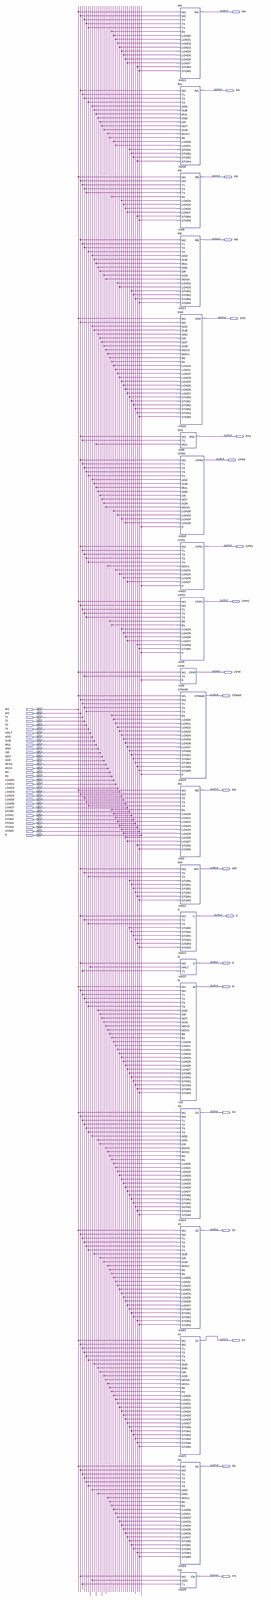
[diagram p0: schematic sheet, whole]
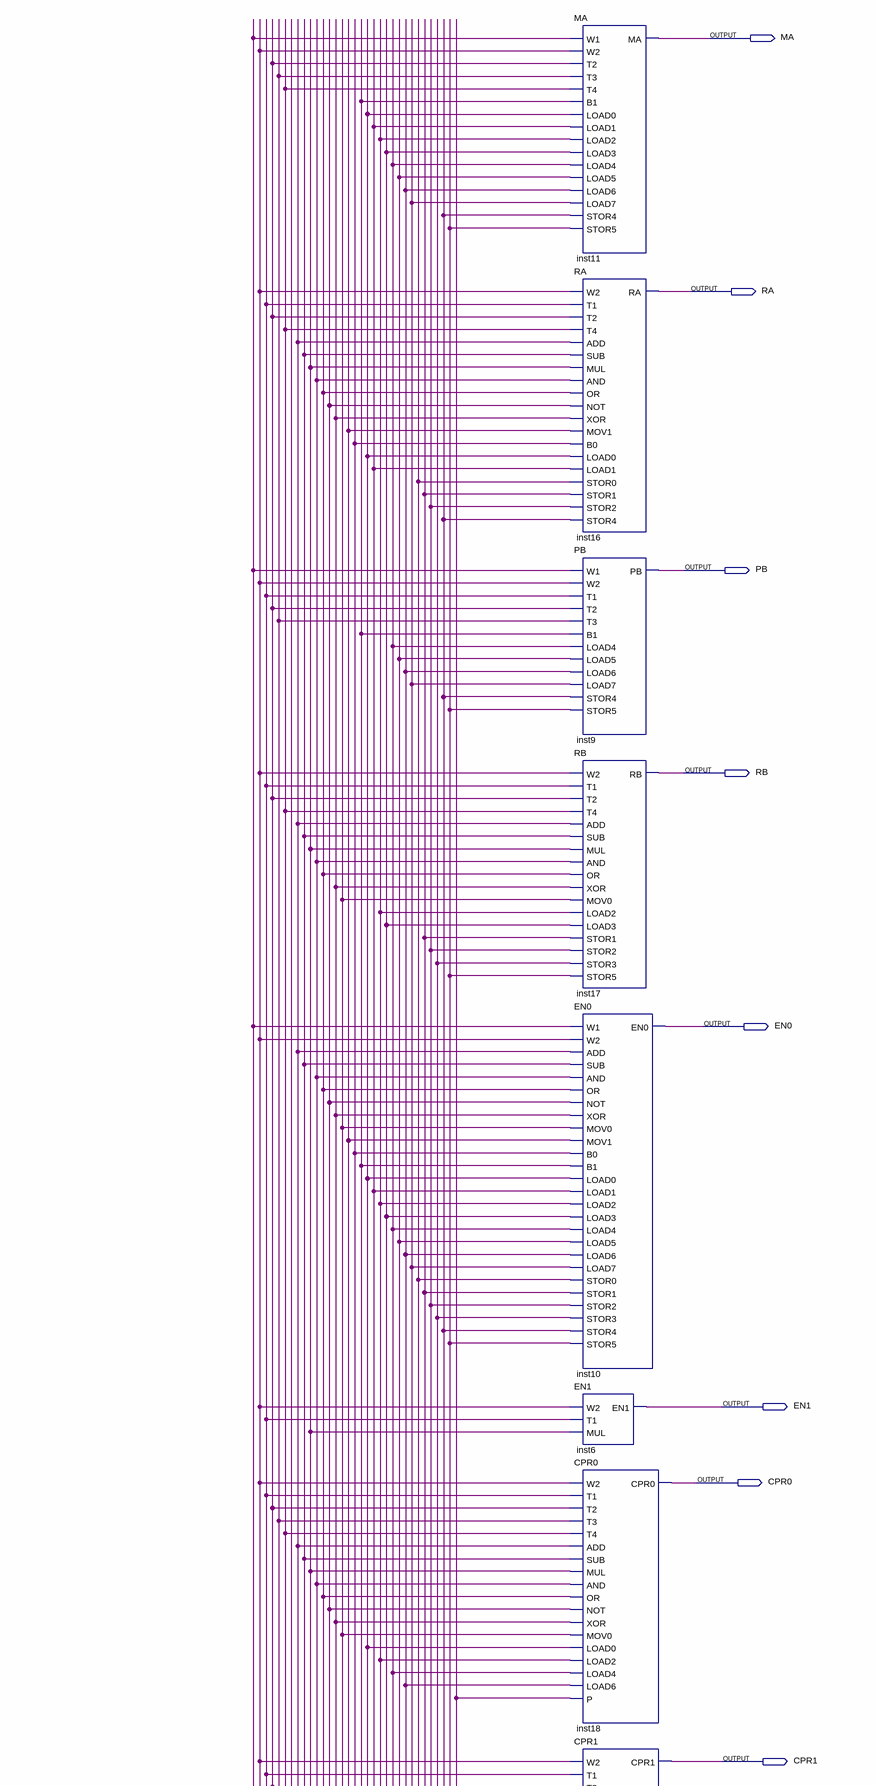
[diagram p1: schematic sheet, upper part]
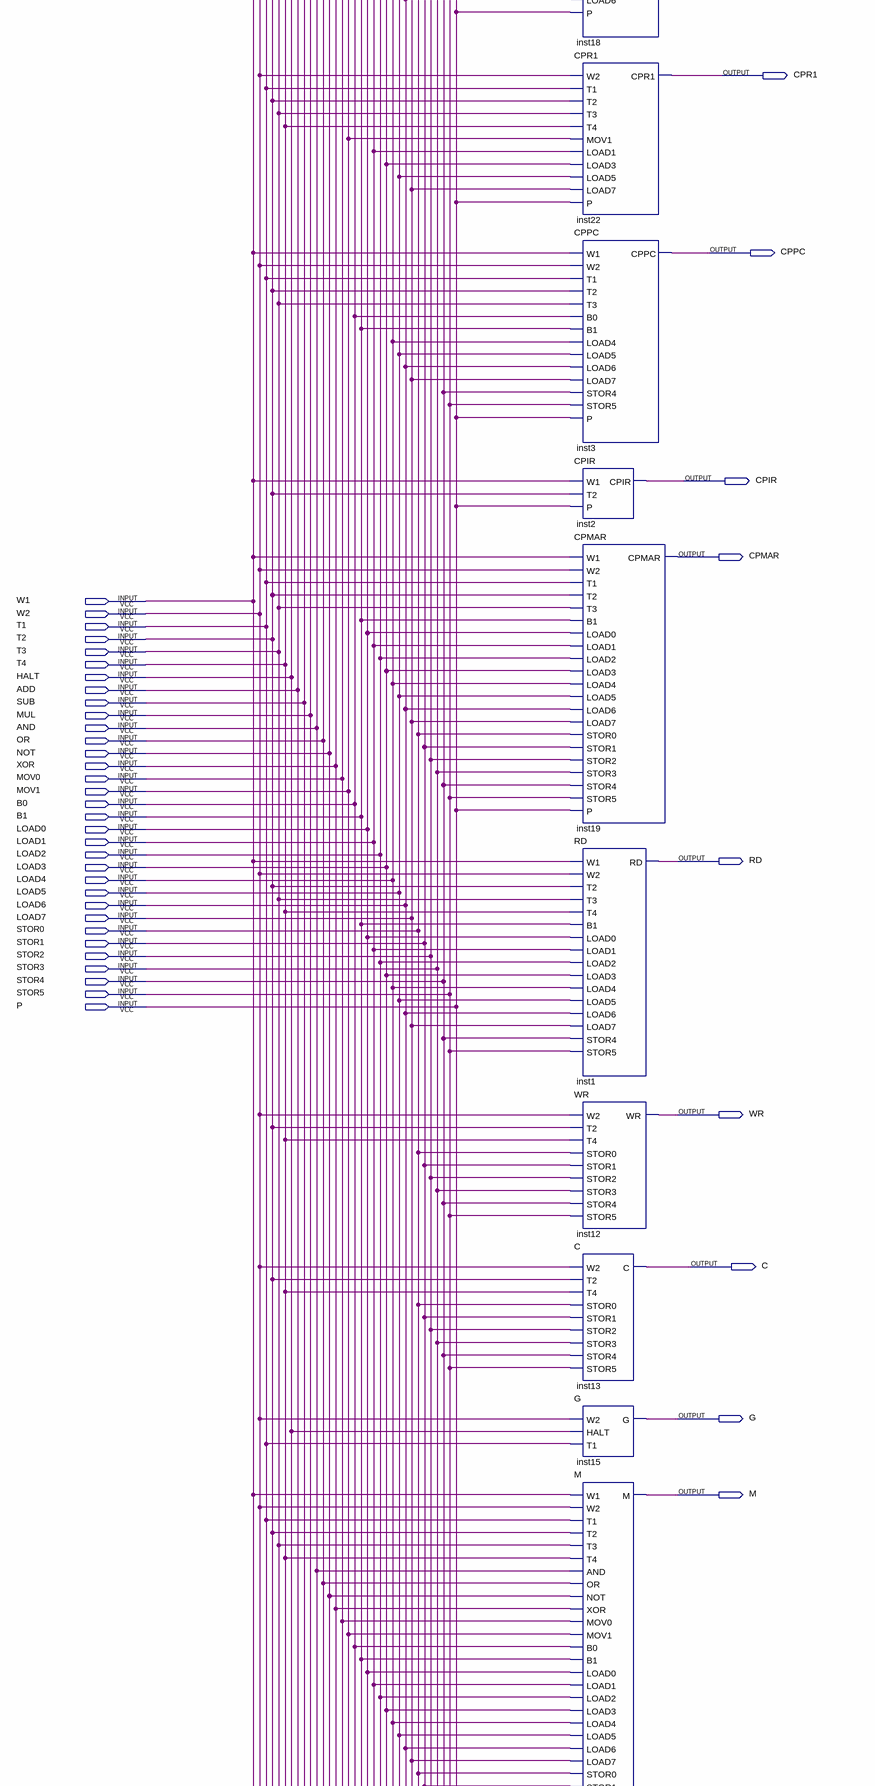
[diagram p2: schematic sheet, middle part]
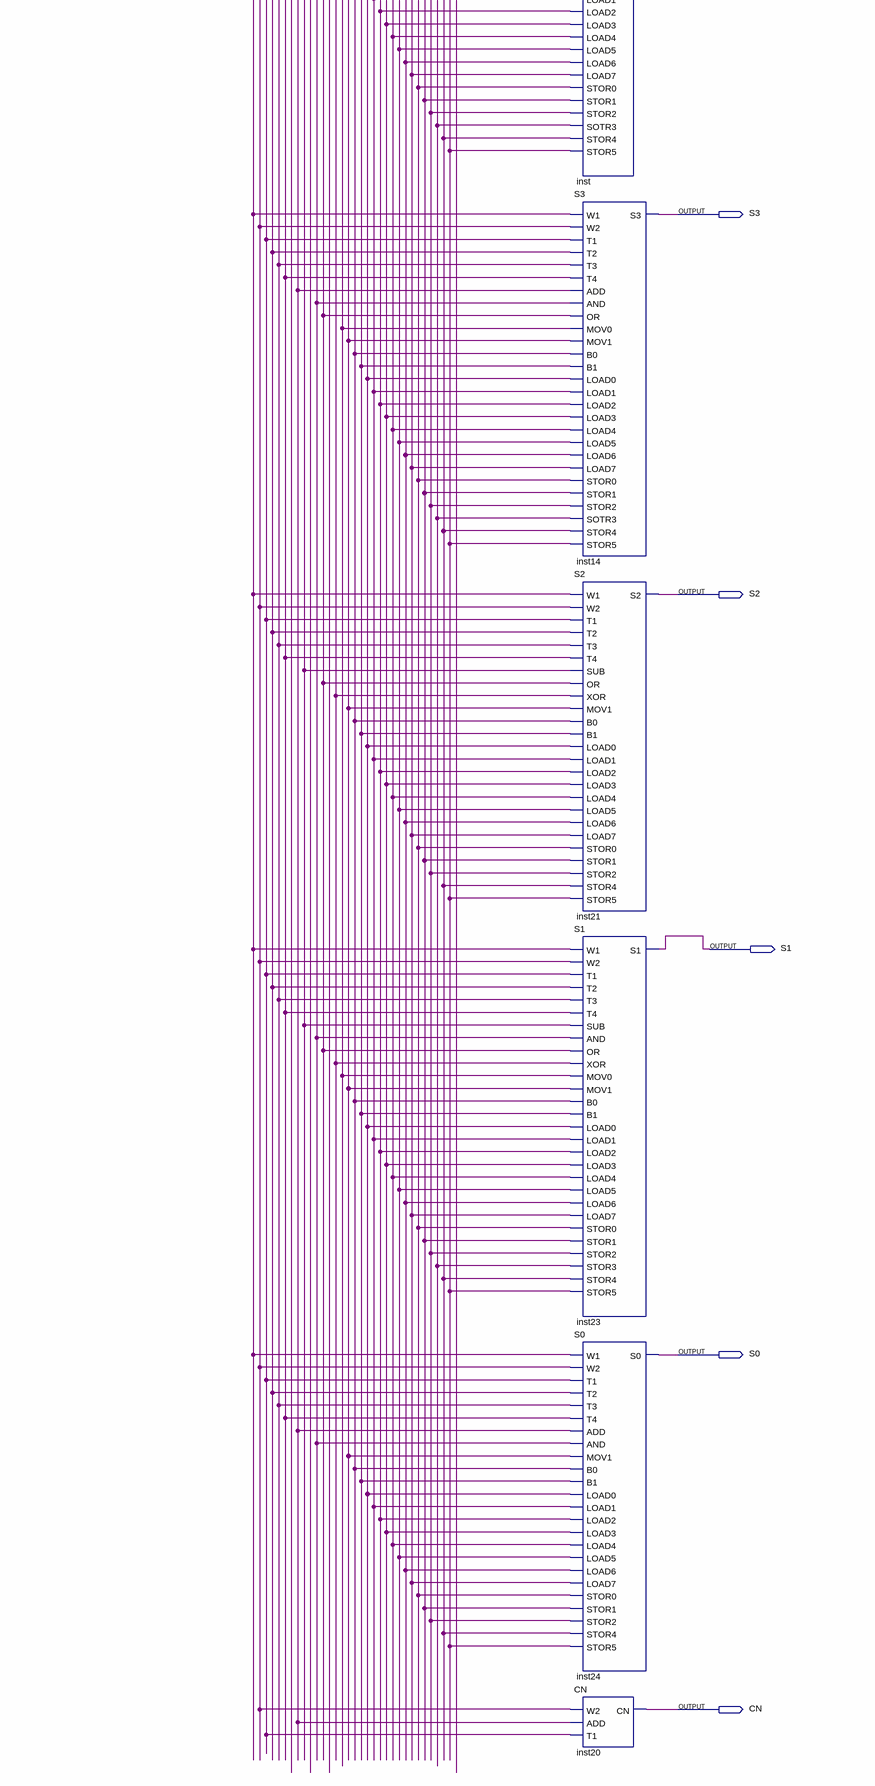
[diagram p3: schematic sheet, lower part]
// Quartus schematic Controller.bdf as structural Verilog: 21 symbols, 54 pins
module Controller (
  input  W1,
  input  W2,
  input  T1,
  input  T2,
  input  T3,
  input  T4,
  input  HALT,
  input  ADD,
  input  SUB,
  input  MUL,
  input  AND,
  input  OR,
  input  NOT,
  input  XOR,
  input  MOV0,
  input  MOV1,
  input  B0,
  input  B1,
  input  LOAD0,
  input  LOAD1,
  input  LOAD2,
  input  LOAD3,
  input  LOAD4,
  input  LOAD5,
  input  LOAD6,
  input  LOAD7,
  input  STOR0,
  input  STOR1,
  input  STOR2,
  input  STOR3,
  input  STOR4,
  input  STOR5,
  input  P,
  output MA,
  output RA,
  output PB,
  output RB,
  output EN0,
  output EN1,
  output CPR0,
  output CPR1,
  output CPPC,
  output CPIR,
  output CPMAR,
  output RD,
  output WR,
  output C,
  output G,
  output M,
  output S3,
  output S2,
  output S1,
  output S0,
  output CN
);

  MA inst11 (
    .W1(W1), .W2(W2), .T2(T2), .T3(T3), .T4(T4), .B1(B1), .LOAD0(LOAD0), .LOAD1(LOAD1), .LOAD2(LOAD2),
    .LOAD3(LOAD3), .LOAD4(LOAD4), .LOAD5(LOAD5), .LOAD6(LOAD6), .LOAD7(LOAD7), .STOR4(STOR4), .STOR5(STOR5),
    .MA(MA));
  RA inst16 (
    .W2(W2), .T1(T1), .T2(T2), .T4(T4), .ADD(ADD), .SUB(SUB), .MUL(MUL), .AND(AND), .OR(OR), .NOT(NOT),
    .XOR(XOR), .MOV1(MOV1), .B0(B0), .LOAD0(LOAD0), .LOAD1(LOAD1), .STOR0(STOR0), .STOR1(STOR1),
    .STOR2(STOR2), .STOR4(STOR4), .RA(RA));
  PB inst9 (
    .W1(W1), .W2(W2), .T1(T1), .T2(T2), .T3(T3), .B1(B1), .LOAD4(LOAD4), .LOAD5(LOAD5), .LOAD6(LOAD6),
    .LOAD7(LOAD7), .STOR4(STOR4), .STOR5(STOR5), .PB(PB));
  RB inst17 (
    .W2(W2), .T1(T1), .T2(T2), .T4(T4), .ADD(ADD), .SUB(SUB), .MUL(MUL), .AND(AND), .OR(OR), .XOR(XOR),
    .MOV0(MOV0), .LOAD2(LOAD2), .LOAD3(LOAD3), .STOR1(STOR1), .STOR2(STOR2), .STOR3(STOR3), .STOR5(STOR5),
    .RB(RB));
  EN0 inst10 (
    .W1(W1), .W2(W2), .ADD(ADD), .SUB(SUB), .AND(AND), .OR(OR), .NOT(NOT), .XOR(XOR), .MOV0(MOV0),
    .MOV1(MOV1), .B0(B0), .B1(B1), .LOAD0(LOAD0), .LOAD1(LOAD1), .LOAD2(LOAD2), .LOAD3(LOAD3), .LOAD4(LOAD4),
    .LOAD5(LOAD5), .LOAD6(LOAD6), .LOAD7(LOAD7), .STOR0(STOR0), .STOR1(STOR1), .STOR2(STOR2), .STOR3(STOR3),
    .STOR4(STOR4), .STOR5(STOR5), .EN0(EN0));
  EN1 inst6 (.W2(W2), .T1(T1), .MUL(MUL), .EN1(EN1));
  CPR0 inst18 (
    .W2(W2), .T1(T1), .T2(T2), .T3(T3), .T4(T4), .ADD(ADD), .SUB(SUB), .MUL(MUL), .AND(AND), .OR(OR),
    .NOT(NOT), .XOR(XOR), .MOV0(MOV0), .LOAD0(LOAD0), .LOAD2(LOAD2), .LOAD4(LOAD4), .LOAD6(LOAD6), .P(P),
    .CPR0(CPR0));
  CPR1 inst22 (
    .W2(W2), .T1(T1), .T2(T2), .T3(T3), .T4(T4), .MOV1(MOV1), .LOAD1(LOAD1), .LOAD3(LOAD3), .LOAD5(LOAD5),
    .LOAD7(LOAD7), .P(P), .CPR1(CPR1));
  CPPC inst3 (
    .W1(W1), .W2(W2), .T1(T1), .T2(T2), .T3(T3), .B0(B0), .B1(B1), .LOAD4(LOAD4), .LOAD5(LOAD5),
    .LOAD6(LOAD6), .LOAD7(LOAD7), .STOR4(STOR4), .STOR5(STOR5), .P(P), .CPPC(CPPC));
  CPIR inst2 (.W1(W1), .T2(T2), .P(P), .CPIR(CPIR));
  CPMAR inst19 (
    .W1(W1), .W2(W2), .T1(T1), .T2(T2), .T3(T3), .B1(B1), .LOAD0(LOAD0), .LOAD1(LOAD1), .LOAD2(LOAD2),
    .LOAD3(LOAD3), .LOAD4(LOAD4), .LOAD5(LOAD5), .LOAD6(LOAD6), .LOAD7(LOAD7), .STOR0(STOR0), .STOR1(STOR1),
    .STOR2(STOR2), .STOR3(STOR3), .STOR4(STOR4), .STOR5(STOR5), .P(P), .CPMAR(CPMAR));
  RD inst1 (
    .W1(W1), .W2(W2), .T2(T2), .T3(T3), .T4(T4), .B1(B1), .LOAD0(LOAD0), .LOAD1(LOAD1), .LOAD2(LOAD2),
    .LOAD3(LOAD3), .LOAD4(LOAD4), .LOAD5(LOAD5), .LOAD6(LOAD6), .LOAD7(LOAD7), .STOR4(STOR4), .STOR5(STOR5),
    .RD(RD));
  WR inst12 (
    .W2(W2), .T2(T2), .T4(T4), .STOR0(STOR0), .STOR1(STOR1), .STOR2(STOR2), .STOR3(STOR3), .STOR4(STOR4),
    .STOR5(STOR5), .WR(WR));
  C inst13 (
    .W2(W2), .T2(T2), .T4(T4), .STOR0(STOR0), .STOR1(STOR1), .STOR2(STOR2), .STOR3(STOR3), .STOR4(STOR4),
    .STOR5(STOR5), .C(C));
  G inst15 (.W2(W2), .HALT(HALT), .T1(T1), .G(G));
  M inst (
    .W1(W1), .W2(W2), .T1(T1), .T2(T2), .T3(T3), .T4(T4), .AND(AND), .OR(OR), .NOT(NOT), .XOR(XOR),
    .MOV0(MOV0), .MOV1(MOV1), .B0(B0), .B1(B1), .LOAD0(LOAD0), .LOAD1(LOAD1), .LOAD2(LOAD2), .LOAD3(LOAD3),
    .LOAD4(LOAD4), .LOAD5(LOAD5), .LOAD6(LOAD6), .LOAD7(LOAD7), .STOR0(STOR0), .STOR1(STOR1), .STOR2(STOR2),
    .SOTR3(STOR3), .STOR4(STOR4), .STOR5(STOR5), .M(M));
  S3 inst14 (
    .W1(W1), .W2(W2), .T1(T1), .T2(T2), .T3(T3), .T4(T4), .ADD(ADD), .AND(AND), .OR(OR), .MOV0(MOV0),
    .MOV1(MOV1), .B0(B0), .B1(B1), .LOAD0(LOAD0), .LOAD1(LOAD1), .LOAD2(LOAD2), .LOAD3(LOAD3), .LOAD4(LOAD4),
    .LOAD5(LOAD5), .LOAD6(LOAD6), .LOAD7(LOAD7), .STOR0(STOR0), .STOR1(STOR1), .STOR2(STOR2), .SOTR3(STOR3),
    .STOR4(STOR4), .STOR5(STOR5), .S3(S3));
  S2 inst21 (
    .W1(W1), .W2(W2), .T1(T1), .T2(T2), .T3(T3), .T4(T4), .SUB(SUB), .OR(OR), .XOR(XOR), .MOV1(MOV1),
    .B0(B0), .B1(B1), .LOAD0(LOAD0), .LOAD1(LOAD1), .LOAD2(LOAD2), .LOAD3(LOAD3), .LOAD4(LOAD4),
    .LOAD5(LOAD5), .LOAD6(LOAD6), .LOAD7(LOAD7), .STOR0(STOR0), .STOR1(STOR1), .STOR2(STOR2), .STOR4(STOR4),
    .STOR5(STOR5), .S2(S2));
  S1 inst23 (
    .W1(W1), .W2(W2), .T1(T1), .T2(T2), .T3(T3), .T4(T4), .SUB(SUB), .AND(AND), .OR(OR), .XOR(XOR),
    .MOV0(MOV0), .MOV1(MOV1), .B0(B0), .B1(B1), .LOAD0(LOAD0), .LOAD1(LOAD1), .LOAD2(LOAD2), .LOAD3(LOAD3),
    .LOAD4(LOAD4), .LOAD5(LOAD5), .LOAD6(LOAD6), .LOAD7(LOAD7), .STOR0(STOR0), .STOR1(STOR1), .STOR2(STOR2),
    .STOR3(STOR3), .STOR4(STOR4), .STOR5(STOR5), .S1(S1));
  S0 inst24 (
    .W1(W1), .W2(W2), .T1(T1), .T2(T2), .T3(T3), .T4(T4), .ADD(ADD), .AND(AND), .MOV1(MOV1), .B0(B0),
    .B1(B1), .LOAD0(LOAD0), .LOAD1(LOAD1), .LOAD2(LOAD2), .LOAD3(LOAD3), .LOAD4(LOAD4), .LOAD5(LOAD5),
    .LOAD6(LOAD6), .LOAD7(LOAD7), .STOR0(STOR0), .STOR1(STOR1), .STOR2(STOR2), .STOR4(STOR4), .STOR5(STOR5),
    .S0(S0));
  CN inst20 (.W2(W2), .ADD(ADD), .T1(T1), .CN(CN));
endmodule
